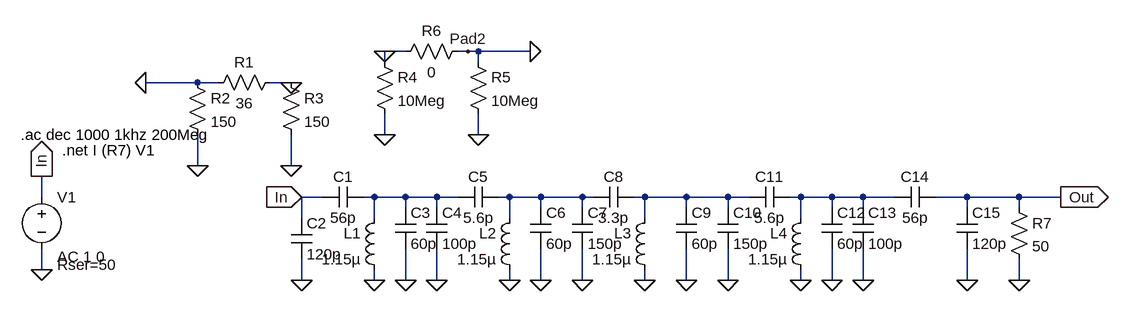
[diagram p0: schematic 300khz bandwith 10mhz LC filter.asc]
* 300khz bandwith 10mhz LC filter.asc
C1 N001 In 56p
C2 In 0 120p
C3 N001 0 60p
C4 N001 0 100p
C5 N002 N001 5.6p
C6 N002 0 60p
C7 N002 0 150p
C8 N003 N002 3.3p
C9 N003 0 60p
C10 N003 0 150p
C11 N004 N003 5.6p
C12 N004 0 60p
C13 N004 0 100p
C14 N004 Out 56p
C15 Out 0 120p
R1 0 0 36
R2 0 0 150
R3 0 0 150
L1 N001 0 1.15µ
L2 N002 0 1.15µ
L3 N003 0 1.15µ
L4 N004 0 1.15µ
V1 In 0 AC 1 0 Rser=50
R4 0 0 10Meg
R5 0 0 10Meg
R6 0 0 0
R7 Out 0 50
.ac dec 1000 1khz 200Meg
.net I (R7) V1
.backanno
.end

* Results of the author's LTspice run, read from the files saved beside the schematic
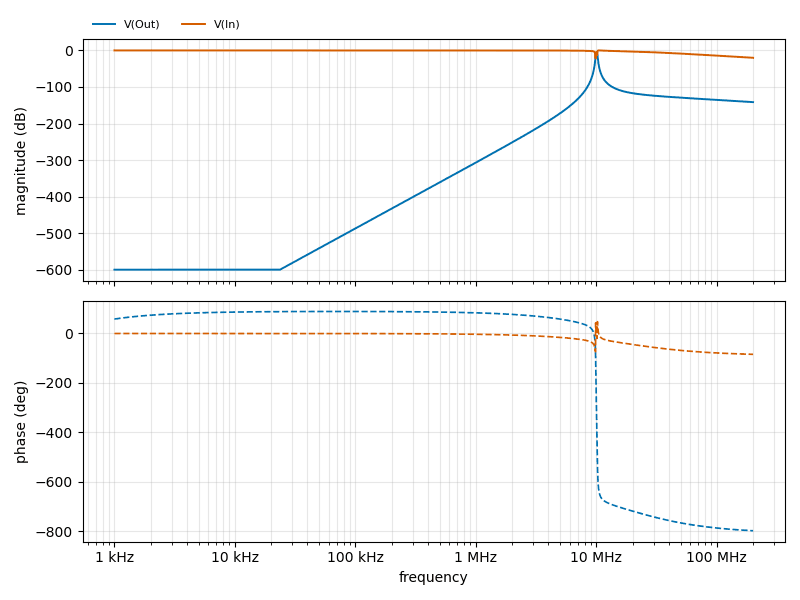
[diagram p1: AC Analysis of 300khz bandwith 10mhz LC filter.asc, plotted from the saved traces]
* AC Analysis, 1 run:
*   V(Out): -600.00 dB at 1 kHz, -141.51 dB at 200 MHz, peak -6.03 dB at 9.954 MHz, 3 dB below the peak at 9.884 MHz and 10.18 MHz
*   V(In): -0.00 dB at 1 kHz, -20.19 dB at 200 MHz, peak -0.00 dB at 1 kHz, 3 dB below the peak at 9.525 MHz